# EAGLE design PowerModule (EAGLE 6.2)
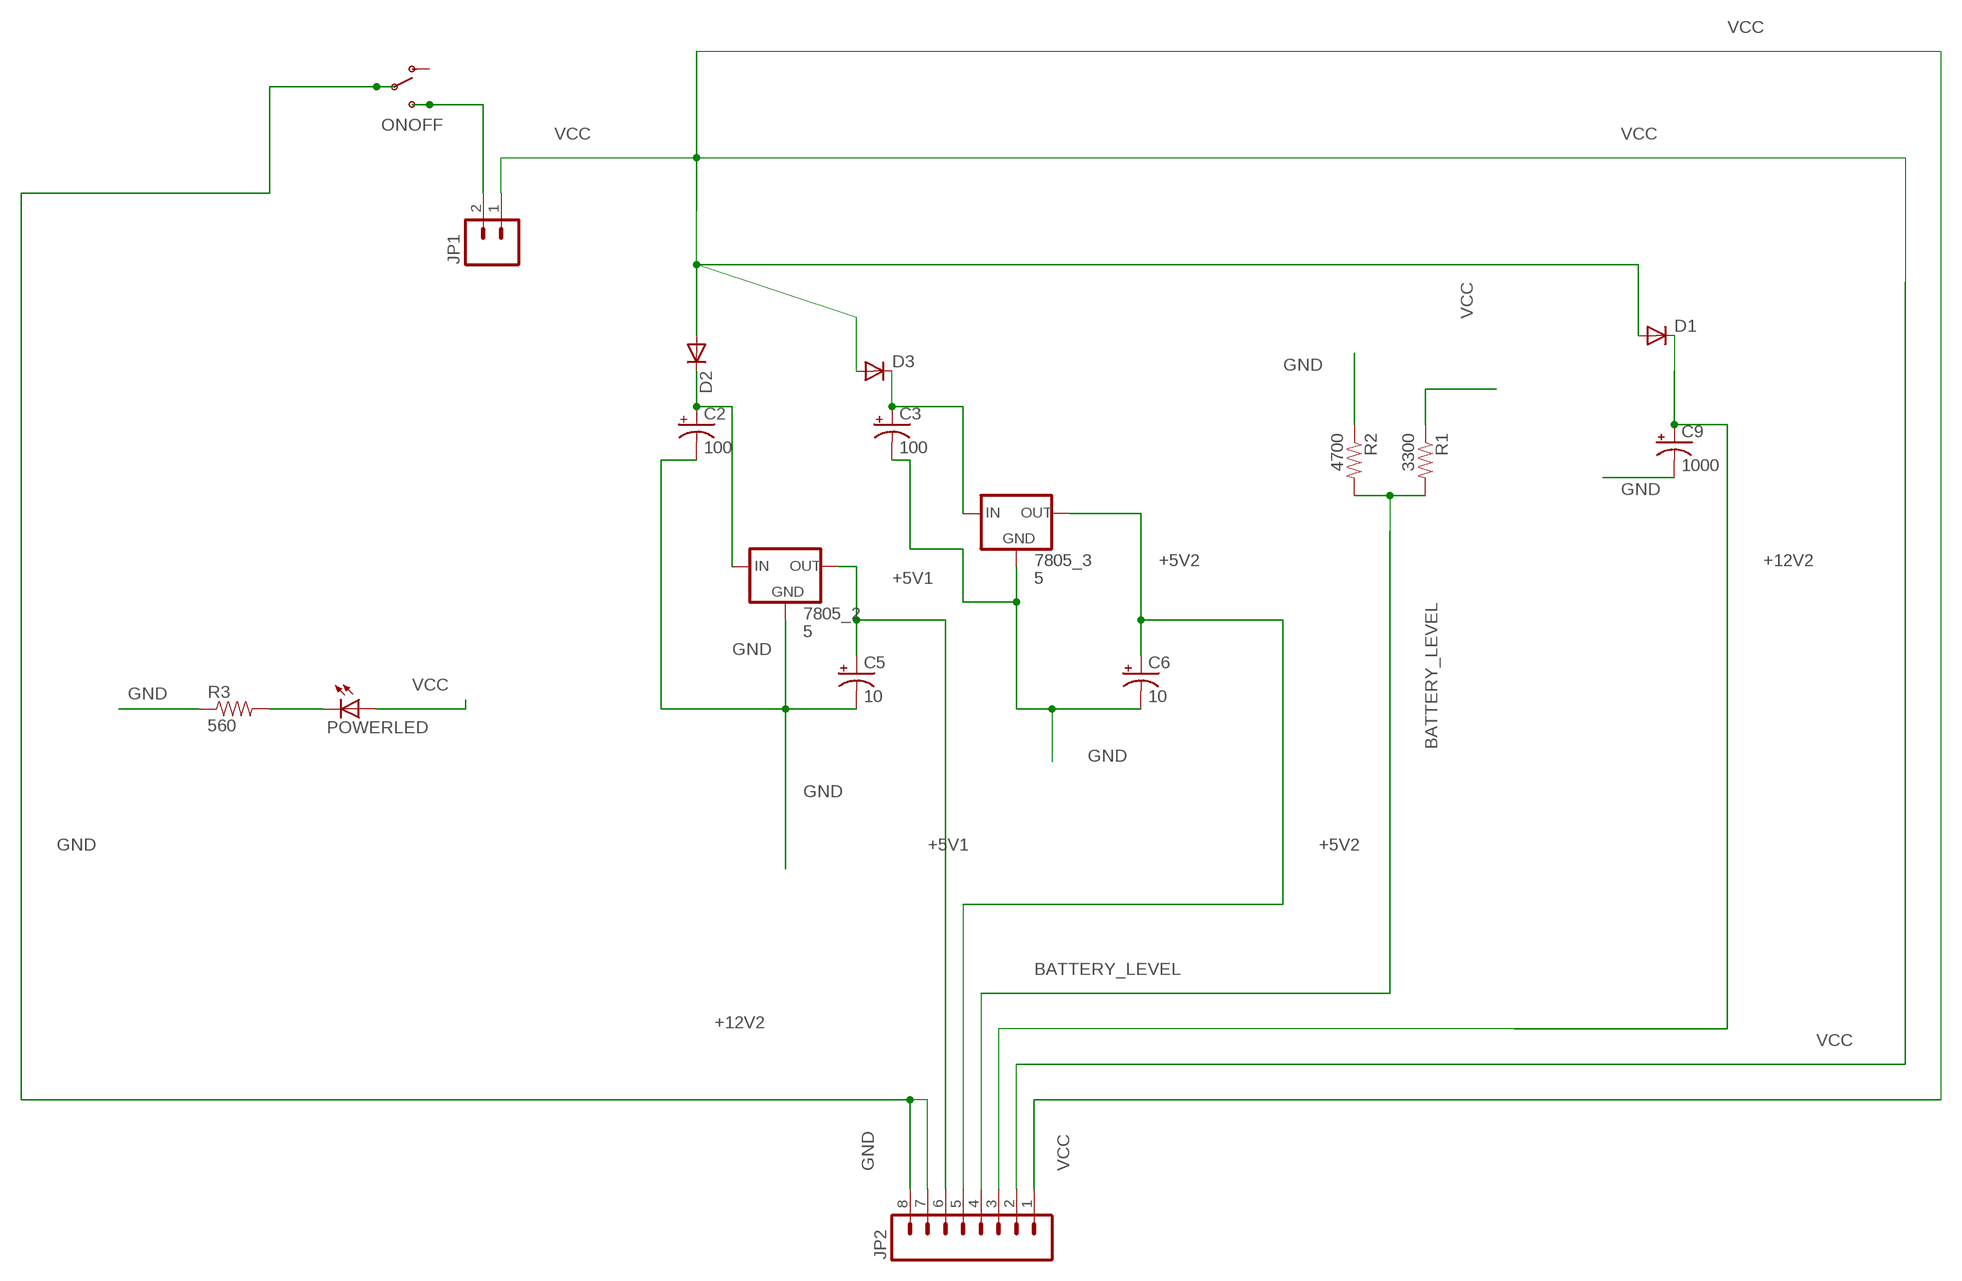
[diagram p0: schematic, sheet 1]

## Parts
7805_2  5  V_REG_78XXSINK  [TO220-IGO]
7805_3  5  V_REG_78XXSINK  [TO220-IGO]
C2  100  CAP_POLPTH1  [CPOL-RADIAL-100UF-25V]
C3  100  CAP_POLPTH1  [CPOL-RADIAL-100UF-25V]
C5  10  CAP_POLPTH2  [CPOL-RADIAL-10UF-25V]
C6  10  CAP_POLPTH2  [CPOL-RADIAL-10UF-25V]
C9  1000  CAP_POLPTH1  [CPOL-RADIAL-100UF-25V]
D1  DIODEPTH  [DIODE-1N4001]
D2  DIODEPTH  [DIODE-1N4001]
D3  DIODEPTH  [DIODE-1N4001]
JP1  M025MM  [SCREWTERMINAL-5MM-2]
JP2  M081X08  [1X08]
ONOFF  SWITCH-SPSTPTH  [SWITCH-SPDT]
POWERLED  LED3MM  [LED3MM]
R1  3300  RESISTORPTH-1/4W  [AXIAL-0.4]
R2  4700  RESISTORPTH-1/4W  [AXIAL-0.4]
R3  560  RESISTORPTH-1/4W  [AXIAL-0.4]

## Nets
+5V1: 7805_2.OUT C5.1(+) JP2.6
+5V2: 7805_3.OUT C6.1(+) JP2.5
+12V2: C9.1(+) D1.C JP2.3
BATTERY_LEVEL: JP2.4 R1.P$2 R2.P$2
GND [2xmotor]: 7805_2.GND 7805_3.GND C2.2(-) C3.2(-) C5.2(-) C6.2(-) C9.2(-) JP2.7 JP2.8 ONOFF.2(P) R2.P$1 R3.P$1
N$2: 7805_2.IN C2.1(+) D2.C
N$3: 7805_3.IN C3.1(+) D3.C
N$4 [2xmotor]: JP1.2 ONOFF.3(S)
N$5: POWERLED.K(C) R3.P$2
VCC [motor]: D1.A D2.A D3.A JP1.1 JP2.1 JP2.2 POWERLED.A R1.P$1
Unconnected: ONOFF.1(O)

## Library data of the parts
7805_2 7805_3 = SparkFun:V_REG_78XX: Voltage Regulator Standard 7805 5V regulator. IGO (Input Ground Output). Spark Fun Electronics SKU : COM-00107
C2 C3 C5 C6 C9 = SparkFun:CAP_POL: Capacitor Polarized These are standard SMD and PTH capacitors. Normally 10uF, 47uF, and 100uF in electrolytic and tantalum varieties. Always verify the external diameter of the through hole cap, it varies with capacity, voltage, and manufacturer. The EIA devices should be standard.
D1-D3 = SparkFun:DIODE: Diode These are standard reverse protection diodes and small signal diodes. SMA package can handle up to about 1A. SOD-323 can handle about 200mA. What the SOD-323 package when ordering, there are some mfgs out there that are 5-pin packages.
JP1 = SparkFun:M02: Header 2 Standard 2-pin 0.1" header. Use with straight break away headers (SKU : PRT-00116), right angle break away headers (PRT-00553), swiss pins (PRT-00743), machine pins (PRT-00117), and female headers (PRT-00115). Molex polarized connector foot print use with SKU : PRT-08233 with associated crimp pins and housings.
JP2 = SparkFun:M08: Header 8 Standard 8-pin 0.1" header. Use with straight break away headers (SKU : PRT-00116), right angle break away headers (PRT-00553), swiss pins (PRT-00743), machine pins (PRT-00117), and female headers (PRT-00115).
ONOFF = SparkFun:SWITCH-SPST: SPST Switch Simple slide switch. Spark Fun Electronics SKU : COM-00102
POWERLED = led:LED: LED OSRAM: - CHIPLED LG R971, LG N971, LY N971, LG Q971, LY Q971, LO R971, LY R971 LH N974, LH R974 LS Q976, LO Q976, LY Q976 LO Q996 - Hyper CHIPLED LW Q18S LB Q993, LB Q99A, LB R99A - SideLED LS A670, LO A670, LY A670, LG A670, LP A670 LB A673, LV A673, LT A673, LW A673 LH A674 LY A675 LS A676, LA A676, LO A676, LY A676, LW A676 LS A679, LY A679, LG A679 - Hyper Micro SIDELED® LS Y876, LA Y876, LO Y876, LY Y876 LT Y87S - SmartLED LW L88C, LW L88S LB L89C, LB L89S, LG L890 LS L89K, LO L89K, LY L89K LS L896, LA L896, LO L896, LY L896 - TOPLED LS T670, LO T670, LY T670, LG T670, LP T670 LSG T670, LSP T670, LSY T670, LOP T670, LYG T670 LG T671, LOG T671, LSG T671 LB T673, LV T673, LT T673, LW T673 LH T674 LS T676, LA T676, LO T676, LY T676, LB T676, LH T676, LSB T676, LW T676 LB T67C, LV T67C, LT T67C, LS T67K, LO T67K, LY T67K, LW E67C LS E67B, LA E67B, LO E67B, LY E67B, LB E67C, LV E67C, LT E67C LW T67C LS T679, LY T679, LG T679 LS T770, LO T770, LY T770, LG T770, LP T770 LB T773, LV T773, LT T773, LW T773 LH T774 LS E675, LA E675, LY E675, LS T675 LS T776, LA T776, LO T776, LY T776, LB T776 LHGB T686 LT T68C, LB T68C - Hyper Mini TOPLED® LB M676 - Mini TOPLED Santana® LG M470 LS M47K, LO M47K, LY M47K Source: http://www.osram.convergy.de LUXEON: - LUMILED® LXK2-PW12-R00, LXK2-PW12-S00, LXK2-PW14-U00, LXK2-PW14-V00 LXK2-PM12-R00, LXK2-PM12-S00, LXK2-PM14-U00 LXK2-PE12-Q00, LXK2-PE12-R00, LXK2-PE12-S00, LXK2-PE14-T00, LXK2-PE14-U00 LXK2-PB12-K00, LXK2-PB12-L00, LXK2-PB12-M00, LXK2-PB14-N00, LXK2-PB14-P00, LXK2-PB14-Q00 LXK2-PR12-L00, LXK2-PR12-M00, LXK2-PR14-Q00, LXK2-PR14-R00 LXK2-PD12-Q00, LXK2-PD12-R00, LXK2-PD12-S00 LXK2-PH12-R00, LXK2-PH12-S00 LXK2-PL12-P00, LXK2-PL12-Q00, LXK2-PL12-R00 Source: www.luxeon.com KINGBRIGHT: KA-3528ASYC Source: www.kingbright.com
R1-R3 = SparkFun:RESISTOR: Resistor Basic schematic elements and footprints for 0603, 1206, and PTH resistors.

## Net classes
0 default: width 0.33 mm, drill 0.33 mm, clearance 0.33 mm
1 motor: width 0.33 mm, drill 0.33 mm, clearance 0.33 mm
2 2xmotor: width 0.33 mm, drill 0.33 mm, clearance 0.33 mm

## Board
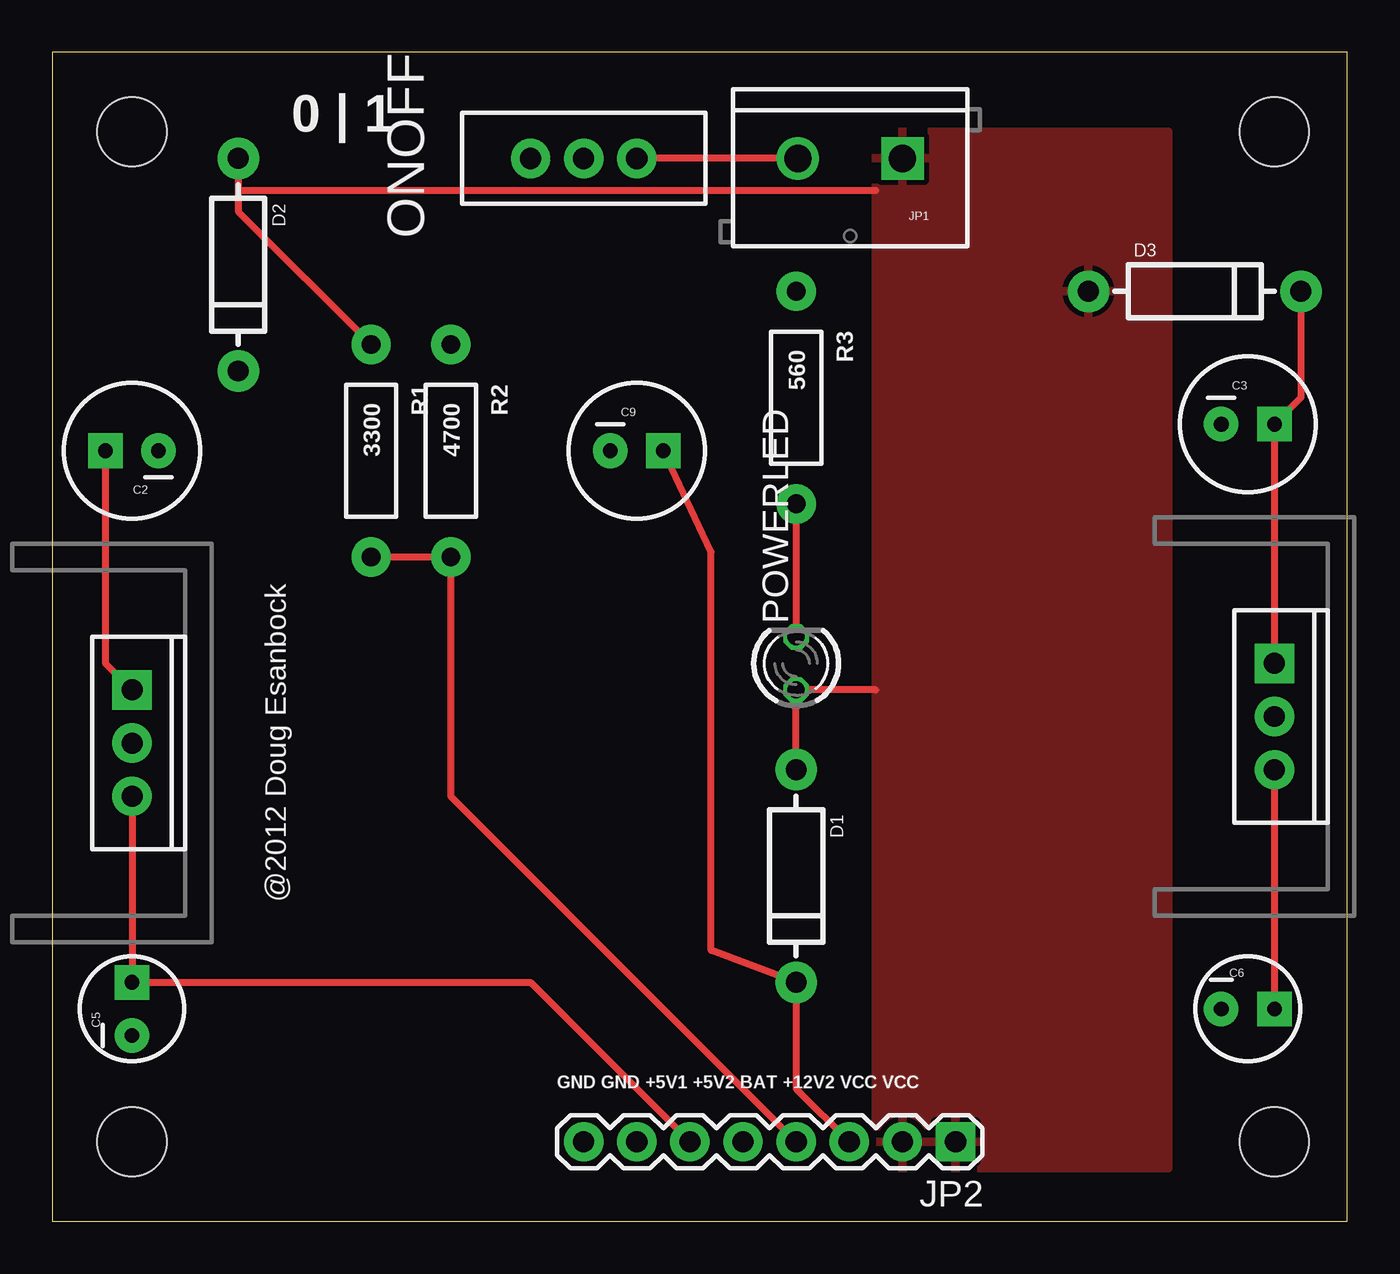
[diagram p1: board, top side]
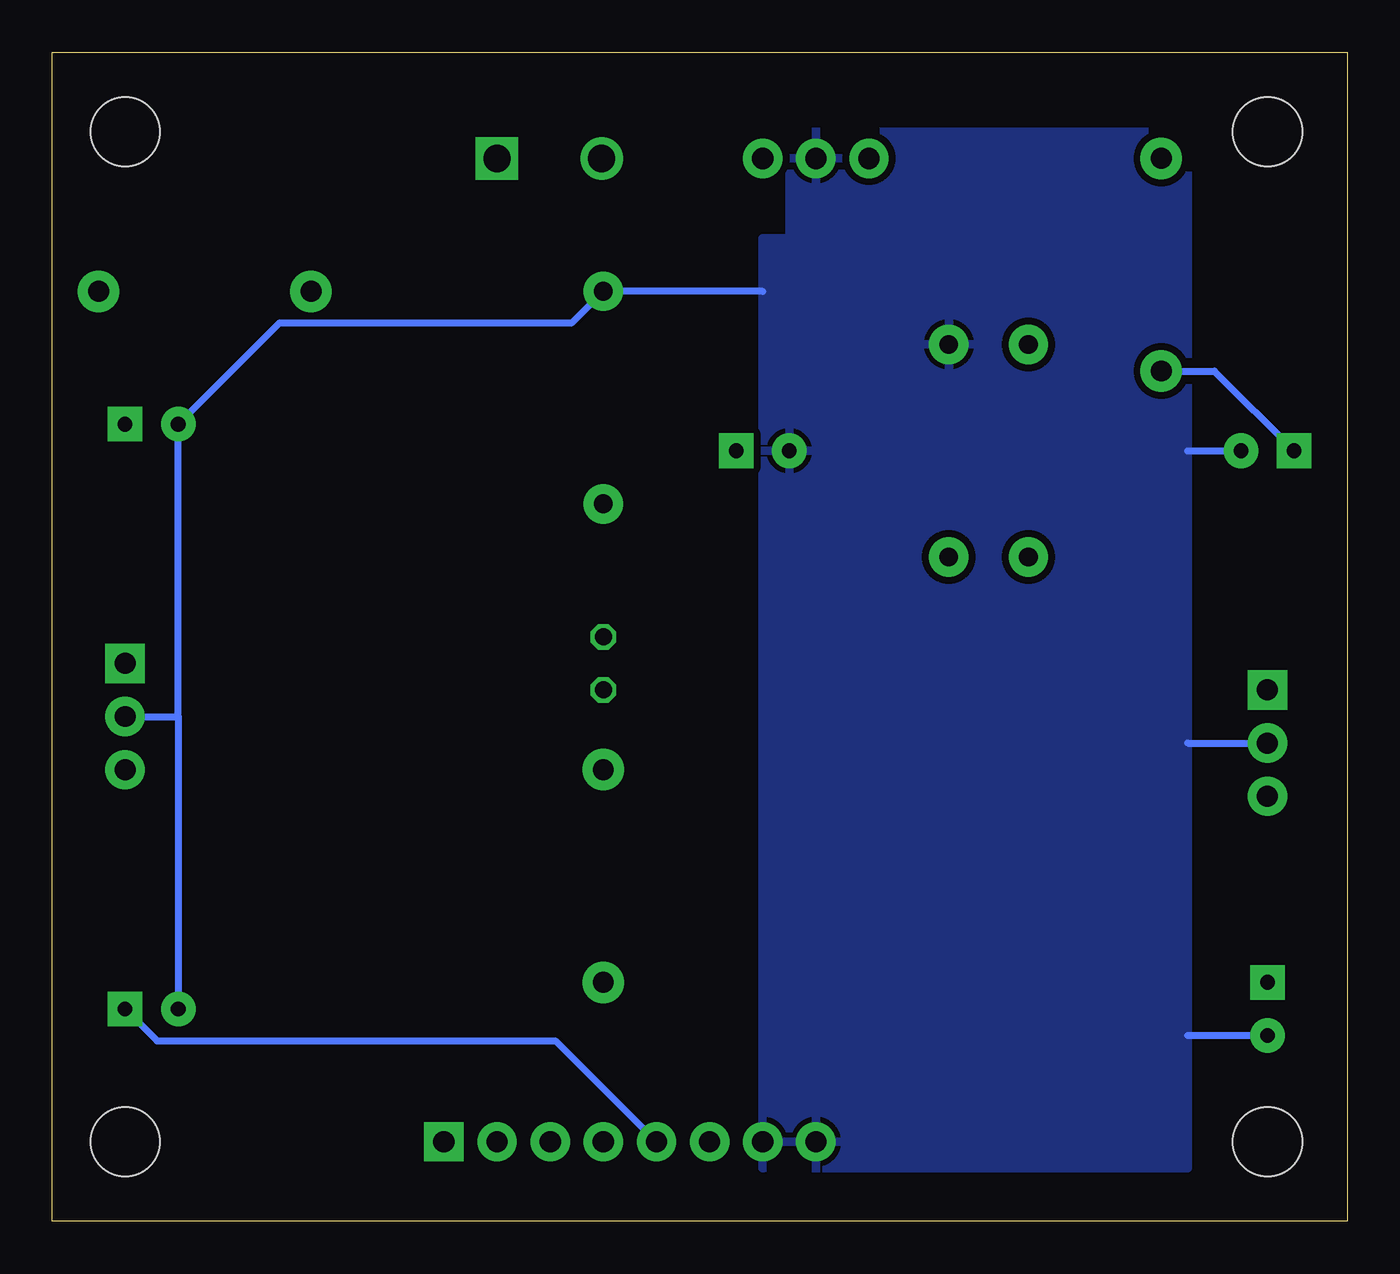
[diagram p2: board, bottom side, seen from below]

Size 61.9 x 55.87 mm. Coordinates in mm from the lower left corner, seen from the top.
Outline: 0,0 61.9,0 61.9,55.87 0,55.87 0,0
Copper layers (1*16): Top 0.0356mm / dielectric 1.5011mm / Bottom 0.0356mm
Design rules: minimum track width 6mil, minimum drill 13mil, track to track 6mil, track to pad 6mil, pad to pad 6mil, via to via 6mil, smd to smd 6mil, copper to edge 15mil, drill to drill 6mil, minimum pad ring 7mil, minimum via ring 7mil, stop-mask expansion 4mil, vias tented up to drill 0mil, thermal gap 10mil

### Footprints (pad centres in the part's own frame; a part is rotated, then mirrored left to right if it is on the bottom)
TO220-IGO = drill 1 pad 1.88: GND 0,0; OUT 2.54,0 | drill 1 pad 1.88 square: IN -2.54,0
CPOL-RADIAL-100UF-25V = drill 0.7 pad 1.651 square: 1 1.27,0 | drill 0.7 pad 1.651: 2 -1.27,0
CPOL-RADIAL-10UF-25V = drill 0.7 pad 1.651 square: 1 1.27,0 | drill 0.7 pad 1.651: 2 -1.27,0
DIODE-1N4001 = drill 1 pad 1.981: A -5.08,0; C 5.08,0
SCREWTERMINAL-5MM-2 = drill 1.3 pad 2.032 square: 1 0,0 | drill 1.3 pad 2.032: 2 5,0
1X08 = drill 1.016 pad 1.88 square: 1 0,0 | drill 1.016 pad 1.88: 2 2.54,0; 3 5.08,0; 4 7.62,0; 5 10.16,0; 6 12.7,0; 7 15.24,0; 8 17.78,0
SWITCH-SPDT = drill 1.016 pad 1.88: 1 0,2.54; 2 0,0; 3 0,-2.54
LED3MM = drill 0.813 octagon: A -1.27,0; K 1.27,0
AXIAL-0.4 = drill 0.9 pad 1.88: P$1 -5.08,0; P$2 5.08,0
STAND-OFF = hole 3.302: 0,0

### Placement (x,y rotation side)
7805_2  3.81,22.86 270 top
7805_3  58.42,24.13 270 top
C2  3.81,36.83 180 top
C3  57.15,38.1 0 top
C5  3.81,10.16 90 top
C6  57.15,10.16 0 top
C9  27.94,36.83 0 top
D1  35.56,16.51 270 top
D2  8.89,45.72 270 top
D3  54.61,44.45 0 top
JP1  40.64,50.8 180 top
JP2  43.18,3.81 180 top
ONOFF  25.4,50.8 90 top
POWERLED  35.56,26.67 90 top
R1  15.24,36.83 270 top
R2  19.05,36.83 270 top
R3  35.56,39.37 270 top
U$1  [STAND-OFF]  58.42,52.07 0 top
U$2  [STAND-OFF]  58.42,3.81 0 top
U$3  [STAND-OFF]  3.81,3.81 0 top
U$4  [STAND-OFF]  3.81,52.07 0 top

### Tracks (layer width: path | path; a pad name or v marks a point on that pad's centre or on a via)
+5V1
  Top 0.33: 7805_2.OUT C5.1 22.86,11.43 JP2.6
+5V2
  Top 0.33: 7805_3.OUT C6.1
  Bottom 0.33: JP2.5 37.85,8.64 56.9,8.64 C6.1
+12V2
  Top 0.33: C9.1 31.5,32 31.5,12.95 D1.C 35.56,6.35 JP2.3
BATTERY_LEVEL
  Top 0.33: R1.P$2 R2.P$2 19.05,20.32 JP2.4
GND
  Bottom 0.33: 55.88,24.13 C6.2 | 7805_3.GND 55.88,24.13 | 55.88,24.13 C3.2 51.05,42.93 37.08,42.93 R3.P$1 27.94,44.45 | 7.62,8.89 C5.2 | 7.62,36.83 C2.2 | 7.62,22.86 7805_2.GND
  pour Bottom: 7.62,52.07 26.67,52.07 26.67,46.99 27.94,46.99 27.94,2.54 7.62,2.54
N$2
  Top 0.33: 7805_2.IN 2.54,26.67 C2.1
  Bottom 0.33: C2.1 6.35,40.64 D2.C
N$3
  Top 0.33: D3.C 59.69,39.37 C3.1 7805_3.IN
N$4
  Top 0.33: JP1.2 ONOFF.3
N$5
  Top 0.33: R3.P$2 POWERLED.K
VCC
  Top 0.33: 39.37,25.4 POWERLED.A D1.A | R1.P$1 8.89,48.26 8.89,49.28 | D2.A 8.89,49.28 | 8.89,49.28 39.37,49.28
  pour Top: 39.37,52.07 53.34,52.07 53.34,2.54 39.37,2.54

### Text on the board
tPlace: 0 | 1 | @2012 Doug Esanbock | GND GND +5V1 +5V2 BAT +12V2 VCC VCC